# Altium schematic sheet SH7 - LOAD MONITORING 1.SchDoc: Power Distribution Board Rev2 - Load Monitoring 1
size Letter; DrawnBy: Cindy Li; Organization: UW Robotics; Address1: 200 University Avenue; Address2: Waterloo; Address3: Ontario; Address4: Canada N2L 3G6; DocumentNumber: 7; SheetNumber: 7; SheetTotal: 11
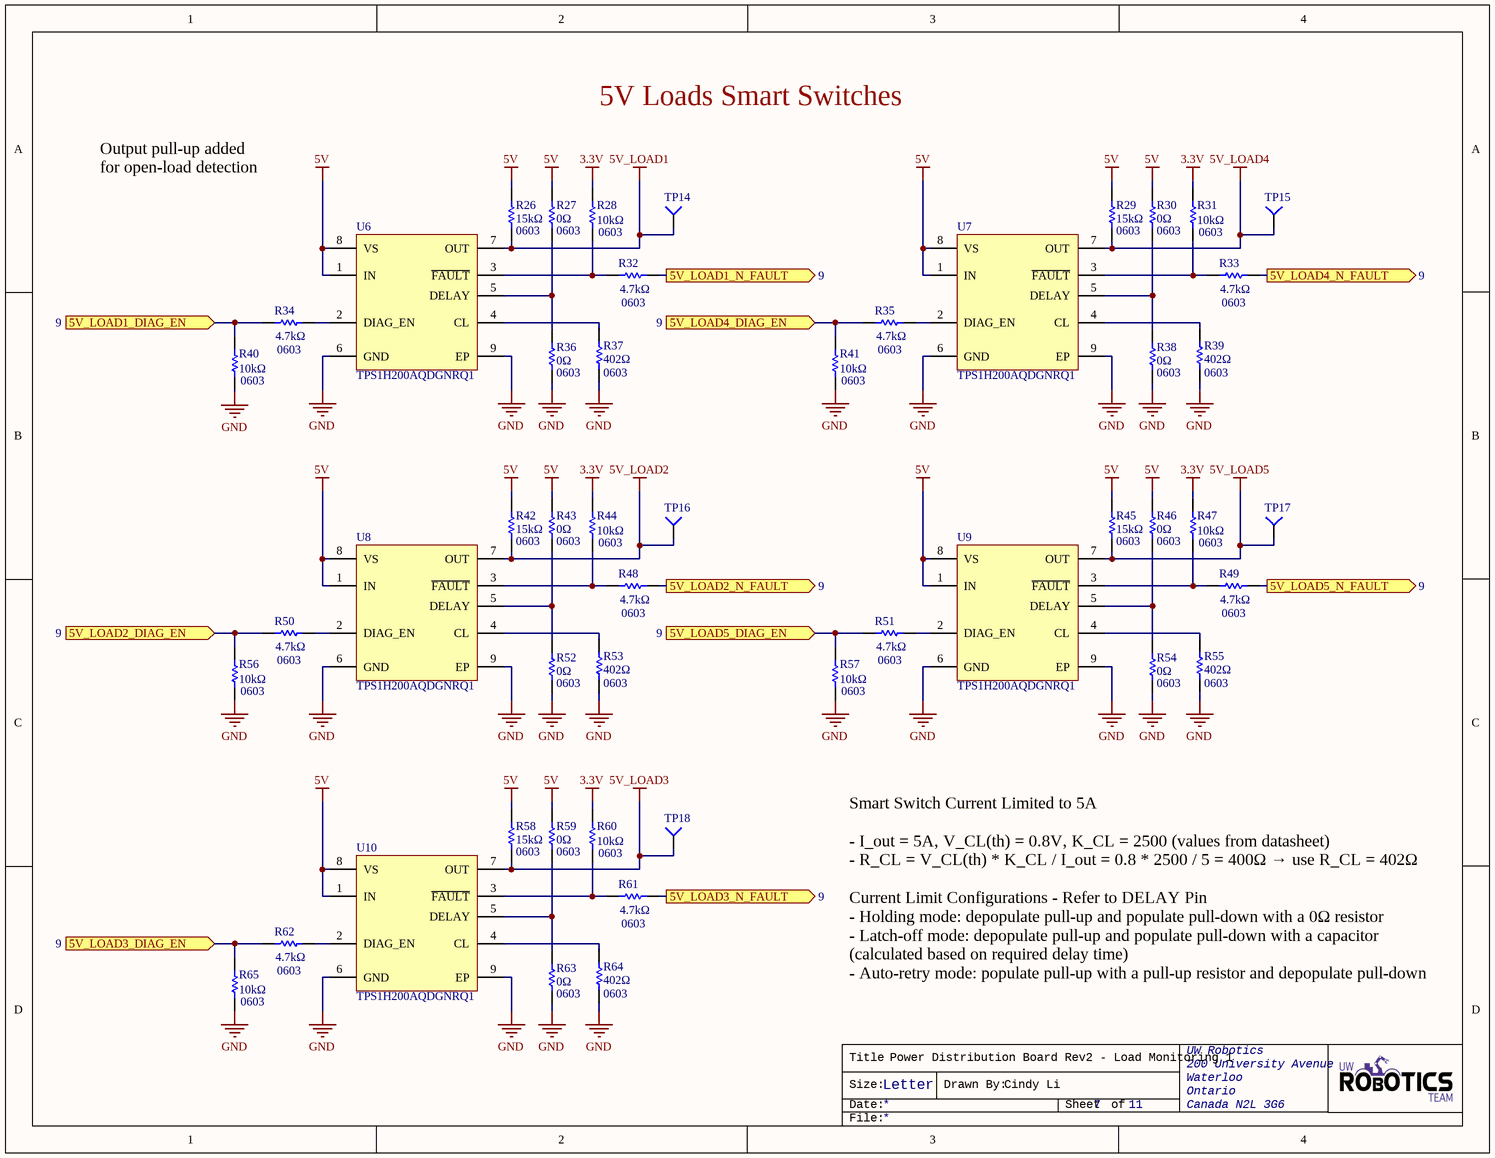
[diagram p0: SH7 - LOAD MONITORING 1.SchDoc]

## Parts
R26  value 15kΩ  Case Code (Imperial): 0603  [RESC0603(1608)_N]  (hidden comment: RES_15kΩ_0603)
R27  value 0Ω  Case Code (Imperial): 0603  [RESC0603(1608)_N]  (hidden comment: RES_0Ω_0603)
R28  value 10kΩ  Case Code (Imperial): 0603  [RESC0603(1608)_N]  (hidden comment: RES_10kΩ_0603)
R29  value 15kΩ  Case Code (Imperial): 0603  [RESC0603(1608)_N]  (hidden comment: RES_15kΩ_0603)
R30  value 0Ω  Case Code (Imperial): 0603  [RESC0603(1608)_N]  (hidden comment: RES_0Ω_0603)
R31  value 10kΩ  Case Code (Imperial): 0603  [RESC0603(1608)_N]  (hidden comment: RES_10kΩ_0603)
R32  value 4.7kΩ  Case Code (Imperial): 0603  [RESC0603(1608)_N]  (hidden comment: RES_4.7kΩ_0603)
R33  value 4.7kΩ  Case Code (Imperial): 0603  [RESC0603(1608)_N]  (hidden comment: RES_4.7kΩ_0603)
R34  value 4.7kΩ  Case Code (Imperial): 0603  [RESC0603(1608)_N]  (hidden comment: RES_4.7kΩ_0603)
R35  value 4.7kΩ  Case Code (Imperial): 0603  [RESC0603(1608)_N]  (hidden comment: RES_4.7kΩ_0603)
R36  value 0Ω  Case Code (Imperial): 0603  [RESC0603(1608)_N]  (hidden comment: RES_0Ω_0603)
R37  Resistance: 402Ω  Case Code (Imperial): 0603  [RESC0603(1608)_N]  (hidden comment: RES_402Ω_0603)
R38  value 0Ω  Case Code (Imperial): 0603  [RESC0603(1608)_N]  (hidden comment: RES_0Ω_0603)
R39  Resistance: 402Ω  Case Code (Imperial): 0603  [RESC0603(1608)_N]  (hidden comment: RES_402Ω_0603)
R40  value 10kΩ  Case Code (Imperial): 0603  [RESC0603(1608)_N]  (hidden comment: RES_10kΩ_0603)
R41  value 10kΩ  Case Code (Imperial): 0603  [RESC0603(1608)_N]  (hidden comment: RES_10kΩ_0603)
R42  value 15kΩ  Case Code (Imperial): 0603  [RESC0603(1608)_N]  (hidden comment: RES_15kΩ_0603)
R43  value 0Ω  Case Code (Imperial): 0603  [RESC0603(1608)_N]  (hidden comment: RES_0Ω_0603)
R44  value 10kΩ  Case Code (Imperial): 0603  [RESC0603(1608)_N]  (hidden comment: RES_10kΩ_0603)
R45  value 15kΩ  Case Code (Imperial): 0603  [RESC0603(1608)_N]  (hidden comment: RES_15kΩ_0603)
R46  value 0Ω  Case Code (Imperial): 0603  [RESC0603(1608)_N]  (hidden comment: RES_0Ω_0603)
R47  value 10kΩ  Case Code (Imperial): 0603  [RESC0603(1608)_N]  (hidden comment: RES_10kΩ_0603)
R48  value 4.7kΩ  Case Code (Imperial): 0603  [RESC0603(1608)_N]  (hidden comment: RES_4.7kΩ_0603)
R49  value 4.7kΩ  Case Code (Imperial): 0603  [RESC0603(1608)_N]  (hidden comment: RES_4.7kΩ_0603)
R50  value 4.7kΩ  Case Code (Imperial): 0603  [RESC0603(1608)_N]  (hidden comment: RES_4.7kΩ_0603)
R51  value 4.7kΩ  Case Code (Imperial): 0603  [RESC0603(1608)_N]  (hidden comment: RES_4.7kΩ_0603)
R52  value 0Ω  Case Code (Imperial): 0603  [RESC0603(1608)_N]  (hidden comment: RES_0Ω_0603)
R53  Resistance: 402Ω  Case Code (Imperial): 0603  [RESC0603(1608)_N]  (hidden comment: RES_402Ω_0603)
R54  value 0Ω  Case Code (Imperial): 0603  [RESC0603(1608)_N]  (hidden comment: RES_0Ω_0603)
R55  Resistance: 402Ω  Case Code (Imperial): 0603  [RESC0603(1608)_N]  (hidden comment: RES_402Ω_0603)
R56  value 10kΩ  Case Code (Imperial): 0603  [RESC0603(1608)_N]  (hidden comment: RES_10kΩ_0603)
R57  value 10kΩ  Case Code (Imperial): 0603  [RESC0603(1608)_N]  (hidden comment: RES_10kΩ_0603)
R58  value 15kΩ  Case Code (Imperial): 0603  [RESC0603(1608)_N]  (hidden comment: RES_15kΩ_0603)
R59  value 0Ω  Case Code (Imperial): 0603  [RESC0603(1608)_N]  (hidden comment: RES_0Ω_0603)
R60  value 10kΩ  Case Code (Imperial): 0603  [RESC0603(1608)_N]  (hidden comment: RES_10kΩ_0603)
R61  value 4.7kΩ  Case Code (Imperial): 0603  [RESC0603(1608)_N]  (hidden comment: RES_4.7kΩ_0603)
R62  value 4.7kΩ  Case Code (Imperial): 0603  [RESC0603(1608)_N]  (hidden comment: RES_4.7kΩ_0603)
R63  value 0Ω  Case Code (Imperial): 0603  [RESC0603(1608)_N]  (hidden comment: RES_0Ω_0603)
R64  Resistance: 402Ω  Case Code (Imperial): 0603  [RESC0603(1608)_N]  (hidden comment: RES_402Ω_0603)
R65  value 10kΩ  Case Code (Imperial): 0603  [RESC0603(1608)_N]  (hidden comment: RES_10kΩ_0603)
TP14  TESTPOINT_1MM_CIRCLE  [TESTPOINT_CIRCLE_1MM]  (value not drawn)  (no BOM)
TP15  TESTPOINT_1MM_CIRCLE  [TESTPOINT_CIRCLE_1MM]  (value not drawn)  (no BOM)
TP16  TESTPOINT_1MM_CIRCLE  [TESTPOINT_CIRCLE_1MM]  (value not drawn)  (no BOM)
TP17  TESTPOINT_1MM_CIRCLE  [TESTPOINT_CIRCLE_1MM]  (value not drawn)  (no BOM)
TP18  TESTPOINT_1MM_CIRCLE  [TESTPOINT_CIRCLE_1MM]  (value not drawn)  (no BOM)
U6  Manufacturer Part Number 1: TPS1H200AQDGNRQ1  [DGN0008G]  (hidden comment: TPS1H200A-Q1)
U7  Manufacturer Part Number 1: TPS1H200AQDGNRQ1  [DGN0008G]  (hidden comment: TPS1H200A-Q1)
U8  Manufacturer Part Number 1: TPS1H200AQDGNRQ1  [DGN0008G]  (hidden comment: TPS1H200A-Q1)
U9  Manufacturer Part Number 1: TPS1H200AQDGNRQ1  [DGN0008G]  (hidden comment: TPS1H200A-Q1)
U10  Manufacturer Part Number 1: TPS1H200AQDGNRQ1  [DGN0008G]  (hidden comment: TPS1H200A-Q1)

## Ports
5V_LOAD1_DIAG_EN (in, see 9), 5V_LOAD1_N_FAULT (out, see 9), 5V_LOAD2_DIAG_EN (in, see 9), 5V_LOAD2_N_FAULT (out, see 9), 5V_LOAD3_DIAG_EN (in, see 9), 5V_LOAD3_N_FAULT (out, see 9), 5V_LOAD4_DIAG_EN (in, see 9), 5V_LOAD4_N_FAULT (out, see 9), 5V_LOAD5_DIAG_EN (in, see 9), 5V_LOAD5_N_FAULT (out, see 9)

## Nets
3.3V: R28.2 R31.2 R44.2 R47.2 R60.2
5V: R26.2 R27.2 R29.2 R30.2 R42.2 R43.2 R45.2 R46.2 R58.2 R59.2 U6.1(IN) U6.8(VS) U7.1(IN) U7.8(VS) U8.1(IN) U8.8(VS) U9.1(IN) U9.8(VS) U10.1(IN) U10.8(VS)
5V_LOAD1: R26.1 TP14.1(=value) U6.7(OUT)
5V_LOAD2: R42.1 TP16.1(=value) U8.7(OUT)
5V_LOAD3: R58.1 TP18.1(=value) U10.7(OUT)
5V_LOAD4: R29.1 TP15.1(=value) U7.7(OUT)
5V_LOAD5: R45.1 TP17.1(=value) U9.7(OUT)
GND: R36.1 R37.1 R38.1 R39.1 R40.1 R41.1 R52.1 R53.1 R54.1 R55.1 R56.1 R57.1 R63.1 R64.1 R65.1 U6.6(GND) U6.9(EP) U7.6(GND) U7.9(EP) U8.6(GND) U8.9(EP) U9.6(GND) U9.9(EP) U10.6(GND) U10.9(EP)
5V_LOAD1_DIAG_EN: R34.1 R40.2 ; port 5V_LOAD1_DIAG_EN
5V_LOAD1_N_FAULT: R32.2 ; port 5V_LOAD1_N_FAULT
5V_LOAD2_DIAG_EN: R50.1 R56.2 ; port 5V_LOAD2_DIAG_EN
5V_LOAD2_N_FAULT: R48.2 ; port 5V_LOAD2_N_FAULT
5V_LOAD3_DIAG_EN: R62.1 R65.2 ; port 5V_LOAD3_DIAG_EN
5V_LOAD3_N_FAULT: R61.2 ; port 5V_LOAD3_N_FAULT
5V_LOAD4_DIAG_EN: R35.1 R41.2 ; port 5V_LOAD4_DIAG_EN
5V_LOAD4_N_FAULT: R33.2 ; port 5V_LOAD4_N_FAULT
5V_LOAD5_DIAG_EN: R51.1 R57.2 ; port 5V_LOAD5_DIAG_EN
5V_LOAD5_N_FAULT: R49.2 ; port 5V_LOAD5_N_FAULT
NetR27_1: R27.1 R36.2 U6.5(DELAY)
NetR28_1: R28.1 R32.1 U6.3(~{FAULT})
NetR30_1: R30.1 R38.2 U7.5(DELAY)
NetR31_1: R31.1 R33.1 U7.3(~{FAULT})
NetR34_2: R34.2 U6.2(DIAG_EN)
NetR35_2: R35.2 U7.2(DIAG_EN)
NetR37_2: R37.2 U6.4(CL)
NetR39_2: R39.2 U7.4(CL)
NetR43_1: R43.1 R52.2 U8.5(DELAY)
NetR44_1: R44.1 R48.1 U8.3(~{FAULT})
NetR46_1: R46.1 R54.2 U9.5(DELAY)
NetR47_1: R47.1 R49.1 U9.3(~{FAULT})
NetR50_2: R50.2 U8.2(DIAG_EN)
NetR51_2: R51.2 U9.2(DIAG_EN)
NetR53_2: R53.2 U8.4(CL)
NetR55_2: R55.2 U9.4(CL)
NetR59_1: R59.1 R63.2 U10.5(DELAY)
NetR60_1: R60.1 R61.1 U10.3(~{FAULT})
NetR62_2: R62.2 U10.2(DIAG_EN)
NetR64_2: R64.2 U10.4(CL)

## Notes on the sheet
- 5V Loads Smart Switches
- Output pull-up added for open-load detection
- Smart Switch Current Limited to 5A
  - I_out = 5A, V_CL(th) = 0.8V, K_CL = 2500 (values from datasheet)
  - R_CL = V_CL(th) * K_CL / I_out = 0.8 * 2500 / 5 = 400Ω → use R_CL = 402Ω
  Current Limit Configurations - Refer to DELAY Pin
  - Holding mode: depopulate pull-up and populate pull-down with a 0Ω resistor
  - Latch-off mode: depopulate pull-up and populate pull-down with a capacitor (calculated based on required delay time)
  - Auto-retry mode: populate pull-up with a pull-up resistor and depopulate pull-down
- Title
- Size:
- Date:
- Letter
- Drawn By:
- Sheet
- of
- File:

## Library data of the parts
R26 R29 R42 R45 R58 = RES_15kΩ_0603_5%: RES 15K OHM 5% 1/10W 0603; Manufacturer 1: Yageo; Manufacturer Part Number 1: RC0603JR-0715KL; Package: 0603 (1608 Metric); Dimensions: 0.063" L x 0.031" W (1.60mm x 0.80mm); Supplier Part Number 1: 311-15KGRCT-ND; Supplier 1: Digi-Key; Mount: Surface Mount; Case Code (Metric): 1608; Tolerance: 5%
R27 R30 R36 R38 R43 R46 R52 R54 R59 R63 = RES_0Ω_0603: RES 0 OHM JUMPER 1/10W 0603; Manufacturer 1: Yageo; Manufacturer Part Number 1: RC0603JR-070RL; Package: 0603 (1608 Metric); Dimensions: 0.063" L x 0.031" W (1.60mm x 0.80mm); Supplier Part Number 1: 311-0.0GRCT-ND; Supplier 1: Digi-Key; Mount: Surface Mount; Case Code (Metric): 1608
R28 R31 R40 R41 R44 R47 R56 R57 R60 R65 = RES_10kΩ_0603_5%: RES 10K OHM 5% 1/10W 0603; Manufacturer 1: Yageo; Manufacturer Part Number 1: RC0603JR-0710KL; Package: 0603 (1608 Metric); Dimensions: 0.063" L x 0.031" W (1.60mm x 0.80mm); Supplier Part Number 1: 311-10KGRCT-ND; Supplier 1: Digi-Key; Mount: Surface Mount; Case Code (Metric): 1608; Tolerance: 5%
R32-R35 R48-R51 R61 R62 = RES_4.7kΩ_0603_5%: RES 4.7K OHM 5% 1/10W 0603; Manufacturer 1: Yageo; Manufacturer Part Number 1: RC0603JR-074K7L; Package: 0603 (1608 Metric); Dimensions: 0.063" L x 0.031" W (1.60mm x 0.80mm); Supplier Part Number 1: 311-4.7KGRCT-ND; Supplier 1: Digi-Key; Mount: Surface Mount; Case Code (Metric): 1608; Tolerance: 5%
R37 R39 R53 R55 R64 = RES_402Ω_0603: RES SMD 402 OHM 0.5% 1/10W 0603; Manufacturer 1: Yageo; Manufacturer Part Number 1: RT0603DRD07402RL; Power Rating: 100mW; Voltage Rating: 75V; Temperature Coefficient: 25ppm/°C; Voltage Rating (DC): 50V; Value: 402Ω; Supplier 1: Digi-Key; Min Operating Temperature: -55°C; Max Operating Temperature: 125°C; Termination: SMD/SMT; Length: 1.6mm; Width: 0.8mm; Supplier Part Number 1: 311-402DCT-ND; Dimensions: 0.063" L x 0.031" W (1.60mm x 0.80mm); Mount: Surface Mount; Package: 0603 (1608 Metric); Case Code (Metric): 1608; Height: 0.45mm; Weight: 7.1E-05oz; Tolerance: 0.5%
TP14-TP18 = TESTPOINT_1MM_CIRCLE: TESTPOINT 1MM CIRCLE; Part Number (MPN): *
U6-U10 = TPS1H200A-Q1: IC PWR DRIVER N-CHAN 1:1 8MSOP; Manufacturer 1: Texas Instruments; Number of Outputs: 1; Output Configuration: High Side; Output Type: N-Channel; Supply Voltage: 4V - 40V; Output Current (Max): 2.5A; Rds On (Typ): 200mOhm; Supplier 1: Digi-Key; Supplier Part Number 1: 296-50416-1-ND; Operating Temperature: 40°C - 125°C; Mounting Type: Surface Mount; Package / Case: 8-TSSOP, 8-MSOP (0.118", 3.00mm Width) Exposed Pad